# Altium schematic sheet STM32C011F6U.SchDoc
size 254 x 152 mm
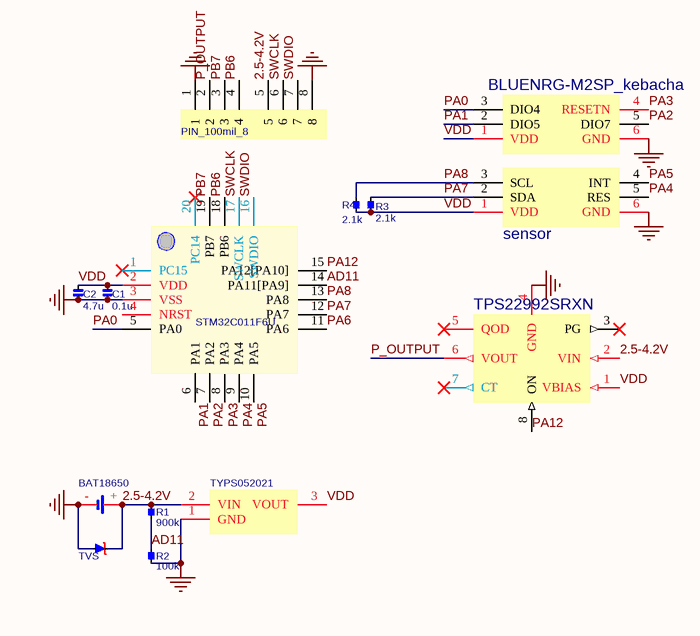
[diagram p0: STM32C011F6U.SchDoc]

## Parts
BAT18650  (no value)
BLUENRG-M2SP_kebacha  (no value)
C1  0.1u  [0805]
C2  4.7u  [0805]
PIN_100mil_8  (no value)
R1  900k  [0805]
R2  100k  [0805]
R3  2.1k  [0805]
R4  2.1k  [0805]
sensor  (no value)
STM32C011F6U  (no value)  [UFQFPN20]
TPS22992SRXN  (no value)
TVS  SMF5.0A  [SMF]  (value not drawn)
TYPS052021  LDO  (value not drawn)

## Nets
GND: BAT18650.- BLUENRG-M2SP_kebacha.6(GND) C1.2 C2.2 PIN_100mil_8.1 PIN_100mil_8.8 R2.1 sensor.6(GND) STM32C011F6U.3(VSS) TPS22992SRXN.4(GND) TVS.1 TYPS052021.1(GND)
2.5-4.2V: BAT18650.+ PIN_100mil_8.5 R1.2 TPS22992SRXN.2(VIN) TVS.2 TYPS052021.2(VIN)
AD11: R1.1 R2.2 STM32C011F6U.14(PA11[PA9])
P_OUTPUT: PIN_100mil_8.2 TPS22992SRXN.6(VOUT)
PA0: BLUENRG-M2SP_kebacha.3(DIO4) STM32C011F6U.5(PA0)
PA1: BLUENRG-M2SP_kebacha.2(DIO5) STM32C011F6U.6(PA1)
PA2: BLUENRG-M2SP_kebacha.5(DIO7) STM32C011F6U.7(PA2)
PA3: BLUENRG-M2SP_kebacha.4(RESETN) STM32C011F6U.8(PA3)
PA4: sensor.5(RES) STM32C011F6U.9(PA4)
PA5: sensor.4(INT) STM32C011F6U.10(PA5)
PA6: STM32C011F6U.11(PA6)
PA7: R3.1 sensor.2(SDA) STM32C011F6U.12(PA7)
PA8: R4.1 sensor.3(SCL) STM32C011F6U.13(PA8)
PA12: STM32C011F6U.15(PA12[PA10]) TPS22992SRXN.8(ON)
PB6: PIN_100mil_8.4 STM32C011F6U.18(PB6)
PB7: PIN_100mil_8.3 STM32C011F6U.19(PB7)
SWCLK: PIN_100mil_8.6 STM32C011F6U.17(SWCLK)
SWDIO: PIN_100mil_8.7 STM32C011F6U.16(SWDIO)
VDD: BLUENRG-M2SP_kebacha.1(VDD) C1.1 C2.1 R3.2 R4.2 sensor.1(VDD) STM32C011F6U.2(VDD) TPS22992SRXN.1(VBIAS) TYPS052021.3(VOUT)

Not connected (* = marked no-connect by the designer): STM32C011F6U 1(PC15)* 4(NRST) 20(PC14)*; TPS22992SRXN 3(PG)* 5(QOD)* 7(CT)*

## Library data of the parts
BAT18650 = BAT18650: 4.2 to 2.5V
BLUENRG-M2SP_kebacha = BLUENRG-M2SP_kebacha
C1 C2 = C
PIN_100mil_8 = PIN_100mil_
R1-R4 = R: 쑹똑: 1%
sensor = sensor
STM32C011F6U = STM32C011F6U
TPS22992SRXN = TPS22992SRXN
TVS = TVS